# EAGLE design pre_amp (EAGLE 7.2.0)
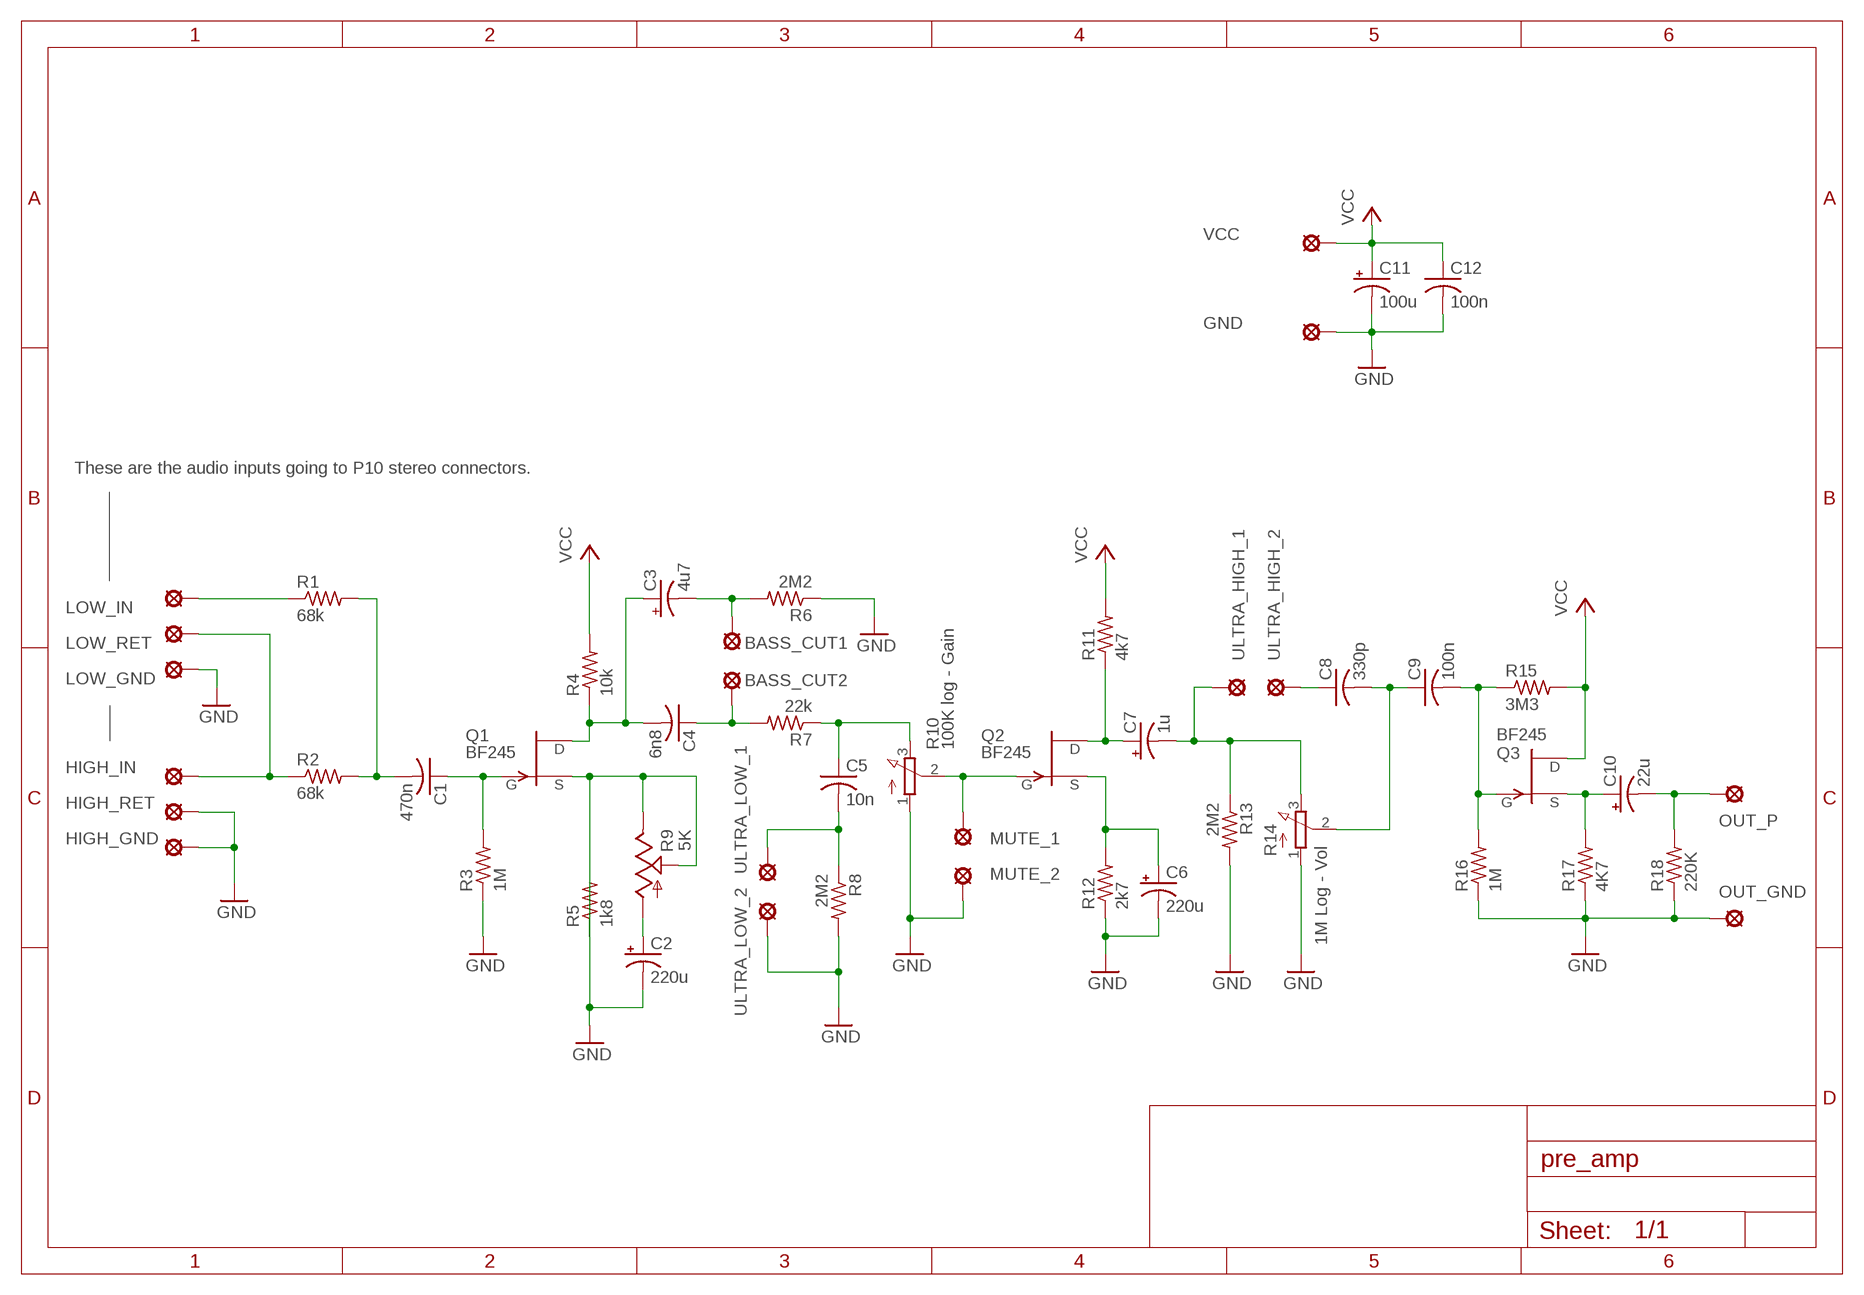
[diagram p0: schematic, sheet 1]

## Parts
BASS_CUT1  MCS08  [MCS08]
BASS_CUT2  MCS08  [MCS08]
C1  470n  C-US050-035X075  [C050-035X075]
C2  220u  CPOL-USE5-8.5  [E5-8,5]
C3  4u7  CPOL-USE2.5-6  [E2,5-6]
C4  6n8  C-US050-030X075  [C050-030X075]
C5  10n  C-US050-030X075  [C050-030X075]
C6  220u  CPOL-USE3.5-8  [E3,5-8]
C7  1u  CPOL-USE2.5-6  [E2,5-6]
C8  330p  C-US050-025X075  [C050-025X075]
C9  100n  C-US075-042X103  [C075-042X103]
C10  22u  CPOL-USE2-5  [E2-5]
C11  100u  CPOL-USE3.5-10  [E3,5-10]
C12  100n  C-US075-042X103  [C075-042X103]
GND  MCS08  [MCS08]
HIGH_GND  MCS08  [MCS08]
HIGH_IN  MCS08  [MCS08]
HIGH_RET  MCS08  [MCS08]
LOW_GND  MCS08  [MCS08]
LOW_IN  MCS08  [MCS08]
LOW_RET  MCS08  [MCS08]
MUTE_1  MCS08  [MCS08]
MUTE_2  MCS08  [MCS08]
OUT_GND  MCS08  [MCS08]
OUT_P  MCS08  [MCS08]
Q1  BF245  [TO92]
Q2  BF245  [TO92]
Q3  BF245  [TO92]
R1  68k  R-US_0204/7  [0204/7]
R2  68k  R-US_0204/7  [0204/7]
R3  1M  R-US_0204/7  [0204/7]
R4  10k  R-US_0204/7  [0204/7]
R5  1k8  R-US_0207/10  [0207/10]
R6  2M2  R-US_0204/7  [0204/7]
R7  22k  R-US_0204/7  [0204/7]
R8  2M2  R-US_0204/7  [0204/7]
R9  5K  TRIM_US-CA6V  [CA6V]
R10  100K log - Gain  3RP/1610N  [3RP/1610N]
R11  4k7  R-US_0204/7  [0204/7]
R12  2k7  R-US_0204/7  [0204/7]
R13  2M2  R-US_0204/7  [0204/7]
R14  1M Log - Vol  3RP/1610N  [3RP/1610N]
R15  3M3  R-US_0204/7  [0204/7]
R16  1M  R-US_0204/7  [0204/7]
R17  4K7  R-US_0204/7  [0204/7]
R18  220K  R-US_0204/7  [0204/7]
ULTRA_HIGH_1  MCS08  [MCS08]
ULTRA_HIGH_2  MCS08  [MCS08]
ULTRA_LOW_1  MCS08  [MCS08]
ULTRA_LOW_2  MCS08  [MCS08]
VCC  MCS08  [MCS08]

## Nets
GND [Power]: C2.- C6.- C11.- C12.2 GND.MP HIGH_GND.MP HIGH_RET.MP LOW_GND.MP MUTE_2.MP OUT_GND.MP R3.1 R5.2 R6.1 R8.2 R10.1(A) R12.1 R13.2 R14.1(A) R16.1 R17.1 R18.1 ULTRA_LOW_2.MP
N$1: C1.2 R1.2 R2.2
N$2: C1.1 Q1.3(G) R3.2
N$3: C3.+ C4.2 Q1.1(D) R4.1
N$4: Q1.2(S) R5.1 R9.E R9.S
N$5: C2.+ R9.A
N$6: LOW_IN.MP R1.1
N$7: HIGH_IN.MP LOW_RET.MP R2.1
N$8: BASS_CUT1.MP C3.- R6.2
N$9: BASS_CUT2.MP C4.1 R7.2
N$10: C5.1 R7.1 R10.3(E)
N$11: C5.2 R8.1 ULTRA_LOW_1.MP
N$12: C7.+ Q2.1(D) R11.1
N$13: C6.+ Q2.2(S) R12.2
N$14: C7.- R13.1 R14.3(E) ULTRA_HIGH_1.MP
N$15: MUTE_1.MP Q2.3(G) R10.2(S)
N$16: C8.2 C9.1 R14.2(S)
N$17: C8.1 ULTRA_HIGH_2.MP
N$18: C9.2 Q3.3(G) R15.1 R16.2
N$19: C10.+ Q3.2(S) R17.2
N$20: C10.- OUT_P.MP R18.2
VCC [Power]: C11.+ C12.1 Q3.1(D) R4.2 R11.2 R15.2 VCC.MP

## Notes on the sheet
- These are the audio inputs going to P10 stereo connectors.

## Library data of the parts
BASS_CUT1 BASS_CUT2 GND HIGH_GND HIGH_IN HIGH_RET LOW_GND LOW_IN LOW_RET MUTE_1 MUTE_2 OUT_GND OUT_P ULTRA_HIGH_1 ULTRA_HIGH_2 ULTRA_LOW_1 ULTRA_LOW_2 VCC = solpad:MCS08: SOLDER PAD MC S0,8, drill 1.2 mm, distributor Buerklin, 08F130
C1 = resistor:C-US: CAPACITOR, American symbol
C2 C3 C6 = resistor:CPOL-US: POLARIZED CAPACITOR, American symbol
C4 C5 C8 C9 C12 = rcl:C-US: CAPACITOR, American symbol
C7 C10 C11 = rcl:CPOL-US: POLARIZED CAPACITOR, American symbol
Q1-Q3 = transistor-fet:BF245: N-Channel Junction FET http://www.onsemi.com/pub/Collateral/BF245A-D.PDF
R1-R8 R11-R13 R15-R18 = resistor:R-US_: RESISTOR, American symbol
R9 = pot:TRIM_US-: POTENTIOMETER
R10 R14 = pot:3RP/1610N: 16mm Potentiometer one level Source: http://www.alphapotentiometers.net/html/16mm_pot_2.html

## Net classes
0 default: width 1.016 mm, clearance 0.813 mm
1 Power: width 1.219 mm, clearance 1.016 mm

## Board
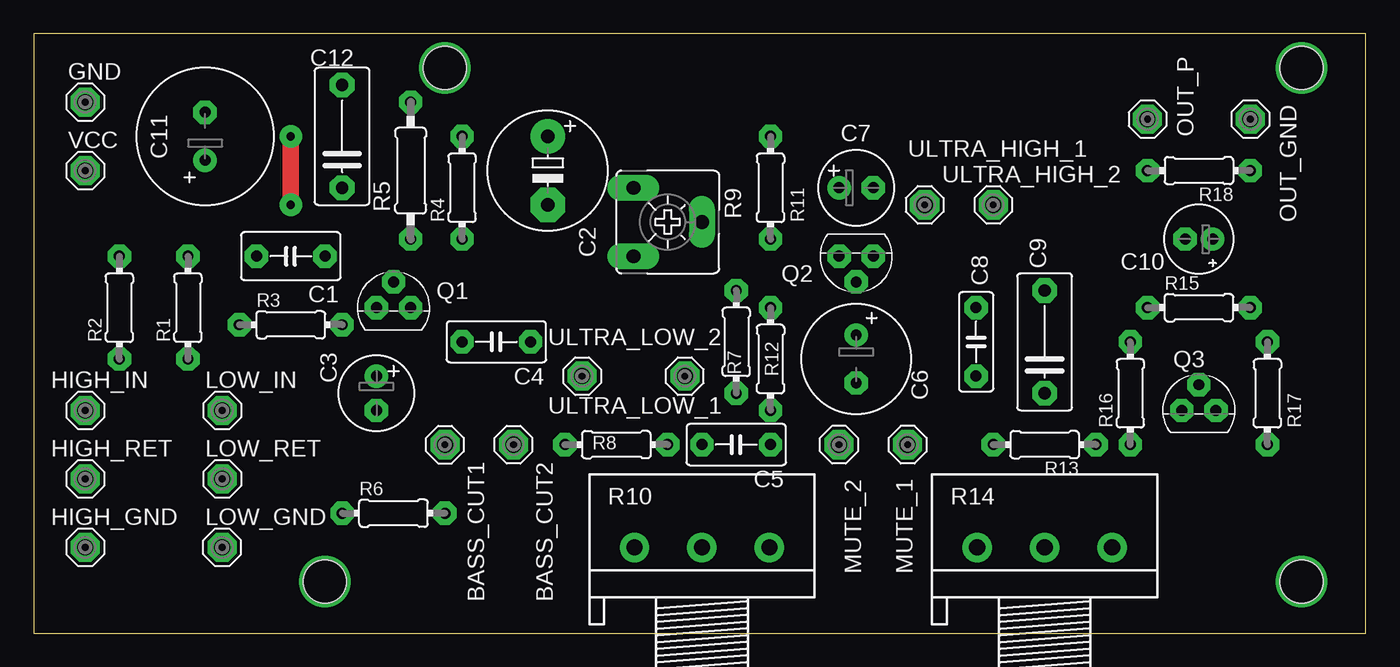
[diagram p1: board, top side]
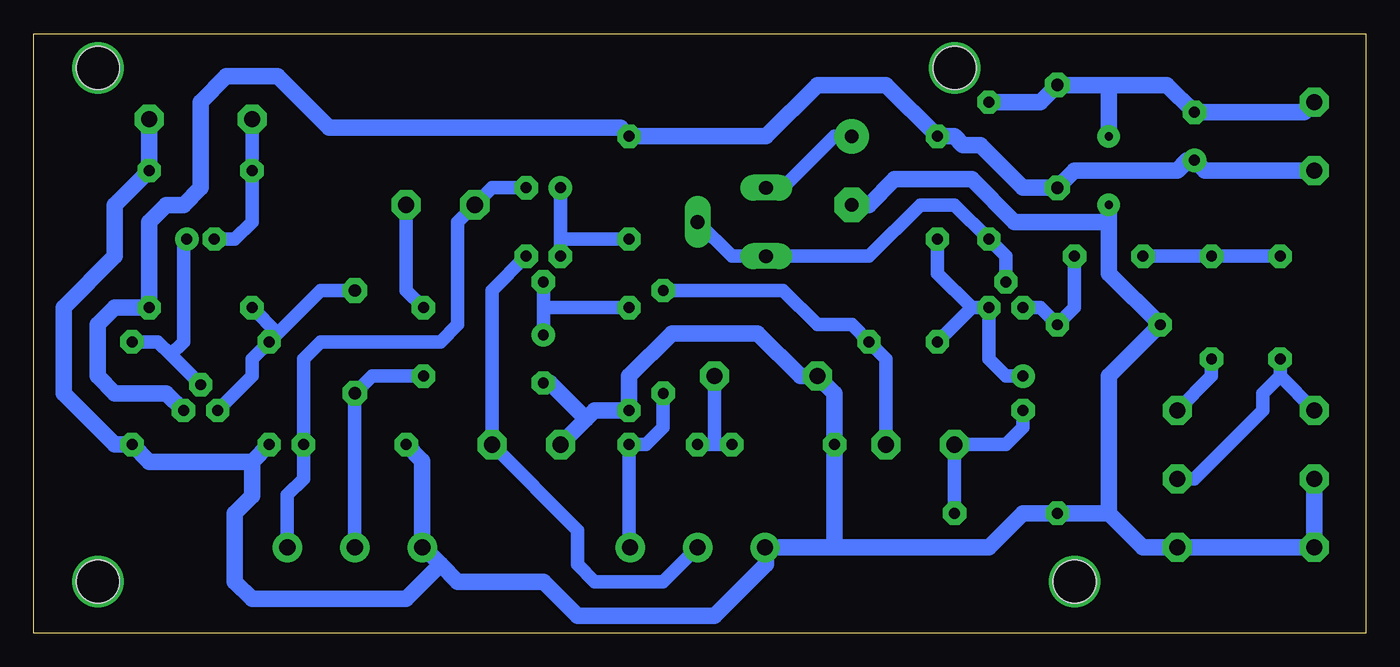
[diagram p2: board, bottom side, seen from below]

Size 98.73 x 44.44 mm. Coordinates in mm from the lower left corner, seen from the top.
Outline: 0,0 98.73,0 98.73,44.44 0,44.44 0,0
Copper layers (1*16): Top 0.035mm / dielectric 1.5mm / Bottom 0.035mm
Design rules "default *": minimum track width 10mil, minimum drill 24mil, track to track 8mil, track to pad 8mil, pad to pad 8mil, via to via 8mil, smd to smd 8mil, copper to edge 40mil, drill to drill 8mil, minimum pad ring 18mil, minimum via ring 8mil, stop-mask expansion 4mil, vias tented up to drill 0mil, thermal gap 10mil
Holes 3.2 mm at 21.59,3.81 30.48,41.91 93.98,3.81 93.98,41.91

### Footprints (pad centres in the part's own frame; a part is rotated, then mirrored left to right if it is on the bottom)
MCS08 = drill 1.194 pad 2.159 octagon: MP 0,0
C050-035X075 = drill 0.813 octagon: 1 -2.54,0; 2 2.54,0
E5-8,5 = drill 1.016 pad 2.54: + -2.54,0 | drill 1.016 pad 2.54 octagon: - 2.54,0
E2,5-6 = drill 0.813 pad 1.6: + -1.27,0 | drill 0.813 pad 1.6 octagon: - 1.27,0
C050-030X075 = drill 0.813 octagon: 1 -2.54,0; 2 2.54,0
E3,5-8 = drill 0.813 pad 1.6: + -1.778,0 | drill 0.813 pad 1.6 octagon: - 1.778,0
C050-025X075 = drill 0.813 octagon: 1 -2.54,0; 2 2.54,0
C075-042X103 = drill 0.914 octagon: 1 -3.81,0; 2 3.81,0
E2-5 = drill 0.813 pad 1.27: + -1.016,0 | drill 0.813 pad 1.27 octagon: - 1.016,0
E3,5-10 = drill 0.813 pad 1.6: + -1.778,0 | drill 0.813 pad 1.6 octagon: - 1.778,0
TO92 = drill 0.813 octagon: 1 1.27,0; 2 0,1.905; 3 -1.27,0
0204/7 = drill 0.813 octagon: 1 -3.81,0; 2 3.81,0
0207/10 = drill 0.813 octagon: 1 -5.08,0; 2 5.08,0
CA6V = drill 1.016 long: A -2.54,-2.54; E 2.54,-2.54; S 0,2.54
3RP/1610N = drill 1.2 pad 2.184: 1 -5,0; 2 0,0; 3 5,0

### Placement (x,y rotation side)
BASS_CUT1  30.48,13.97 90 top
BASS_CUT2  35.56,13.97 180 top
C1  19.05,27.94 180 top
C2  38.1,34.29 270 top
C3  25.4,17.78 270 top
C4  34.29,21.59 180 top
C5  52.07,13.97 180 top
C6  60.96,20.32 270 top
C7  60.96,33.02 0 top
C8  69.85,21.59 270 top
C9  74.93,21.59 90 top
C10  86.36,29.21 180 top
C11  12.7,36.83 90 top
C12  22.86,36.83 90 top
GND  3.81,39.37 0 top
HIGH_GND  3.81,6.35 0 top
HIGH_IN  3.81,16.51 0 top
HIGH_RET  3.81,11.43 0 top
LOW_GND  13.97,6.35 180 top
LOW_IN  13.97,16.51 0 top
LOW_RET  13.97,11.43 0 top
MUTE_1  64.77,13.97 270 top
MUTE_2  59.69,13.97 270 top
OUT_GND  90.17,38.1 0 top
OUT_P  82.55,38.1 0 top
Q1  26.67,24.13 0 top
Q2  60.96,27.94 180 top
Q3  86.36,16.51 0 top
R1  11.43,24.13 90 top
R2  6.35,24.13 90 top
R3  19.05,22.86 0 top
R4  31.75,33.02 90 top
R5  27.94,34.29 90 top
R6  26.67,8.89 0 top
R7  52.07,21.59 90 top
R8  43.18,13.97 180 top
R9  46.99,30.48 270 top
R10  49.53,6.35 0 top
R11  54.61,33.02 90 top
R12  54.61,20.32 90 top
R13  74.93,13.97 180 top
R14  74.93,6.35 0 top
R15  86.36,24.13 0 top
R16  81.28,17.78 90 top
R17  91.44,17.78 90 top
R18  86.36,34.29 180 top
ULTRA_HIGH_1  66.04,31.75 0 top
ULTRA_HIGH_2  71.12,31.75 0 top
ULTRA_LOW_1  48.26,19.05 180 top
ULTRA_LOW_2  40.64,19.05 0 top
VCC  3.81,34.29 0 top

### Tracks (layer width: path | path; a pad name or v marks a point on that pad's centre or on a via)
GND  (via drill 0.61 pad 1.68)
  Top 1.219: v19.05,31.75 v19.05,36.83
  Bottom 1.219: HIGH_RET.MP HIGH_GND.MP LOW_GND.MP 16.51,6.35 19.05,8.89 | 19.05,8.89 R6.1 25.4,8.89 27.94,6.35 39.37,6.35 | 19.05,8.89 19.05,19.05 R3.1 19.05,26.67 19.05,30.48 | GND.MP 4.57,38.61 C11.- 14.73,40.64 19.05,40.64 | 19.05,40.64 C12.2 24.13,39.37 R5.2 | 39.37,6.35 R10.1 44.45,6.27 44.45,5.08 48.26,1.27 58.42,1.27 60.96,3.81 67.31,3.81 68.58,5.08 | 39.37,6.35 R8.2 39.37,17.78 ULTRA_LOW_2.MP 41.91,19.05 45.09,22.23 51.44,22.23 54.61,19.05 R12.1 57.15,16.51 57.78,15.88 | MUTE_2.MP 57.78,15.88 | C6.- 60.45,18.54 57.78,15.88 | R13.2 69.93,12.78 R14.1 69.85,6.35 68.58,5.08 | 82.55,12.7 90.17,12.7 R17.1 92.71,13.97 96.52,17.78 96.52,24.13 92.71,27.94 92.71,31.75 R18.1 OUT_GND.MP | 82.55,12.7 R16.1 | 19.05,30.48 v19.05,31.75 | v19.05,36.83 19.05,40.64 | C2.- 36.83,31.75 34.92,33.66 29.21,33.66 26.04,30.48 19.05,30.48 | 82.55,12.7 82.55,10.16 83.82,8.89 83.82,3.81 82.55,2.54 71.12,2.54 68.58,5.08
N$1
  Bottom 1.016: R2.2 R1.2 C1.2
N$2
  Bottom 1.016: C1.1 21.59,24.13 R3.2 24.13,24.13 Q1.3
N$3
  Bottom 1.016: R4.1 31.75,26.67 29.21,24.13 | 29.21,24.13 Q1.1 27.94,20.32 26.67,19.05 C3.+ | C4.2 29.21,24.13
N$4
  Bottom 1.016: Q1.2 26.67,27.94 R5.1 30.48,31.75 33.02,31.75 36.83,27.94 R9.E 46.99,27.94 R9.S
N$5
  Bottom 1.016: C2.+ 39.37,36.83 43.18,33.02 R9.A
N$6
  Bottom 1.016: LOW_IN.MP 11.43,19.05 R1.1
N$7
  Bottom 1.016: R2.1 6.35,19.05 | 6.35,19.05 HIGH_IN.MP | LOW_RET.MP 12.7,11.43 7.62,16.51 7.62,17.78 6.35,19.05
N$8
  Bottom 1.016: C3.- 25.4,15.24 26.67,13.97 BASS_CUT1.MP R6.2
N$9
  Bottom 1.016: BASS_CUT2.MP 35.56,20.32 C4.1 38.1,22.86 40.64,22.86 43.18,25.4 R7.2
N$10
  Bottom 1.016: R7.1 52.07,15.24 53.34,13.97 C5.1 54.61,6.35 R10.3
N$11
  Bottom 1.016: R8.1 48.26,13.97 | 48.26,13.97 C5.2 | ULTRA_LOW_1.MP 48.26,13.97
N$12
  Bottom 1.016: Q2.1 59.69,29.21 | 59.69,29.21 C7.+ | R11.1 59.69,29.21
N$13
  Bottom 1.016: C6.+ 60.96,24.13 | 60.96,24.13 Q2.2 | R12.2 60.96,24.13
N$14
  Bottom 1.016: C7.- 64.77,33.02 ULTRA_HIGH_1.MP 67.31,30.48 67.31,22.86 68.58,21.59 77.47,21.59 78.74,20.32 R13.1 78.74,11.43 79.93,10.24 R14.3
N$15
  Bottom 1.016: R10.2 52.07,3.81 57.15,3.81 58.42,5.08 58.42,7.62 MUTE_1.MP 64.77,25.4 Q2.3
N$16
  Bottom 1.016: R14.2 C9.1 73.66,19.05 C8.2
N$17
  Bottom 1.016: ULTRA_HIGH_2.MP 71.12,25.4 C8.1
N$18
  Bottom 1.016: C9.2 77.47,25.4 80.64,22.23 | 80.64,22.23 R16.2 82.55,20.32 82.55,19.05 Q3.3 | R15.1 80.64,22.23
N$19
  Bottom 1.016: R17.2 89.53,21.59 88.58,20.64 | 88.58,20.64 Q3.2 | C10.+ 87.63,28.96 87.63,21.59 88.58,20.64
N$20
  Bottom 1.016: C10.- 83.82,29.21 82.55,30.48 R18.2 OUT_P.MP
N$21  (via drill 2.8 pad 3.81)
  other vias: 30.48,41.91
N$22  (via drill 2.8 pad 3.81)
  other vias: 93.98,41.91
N$23  (via drill 2.8 pad 3.81)
  other vias: 93.98,3.81
N$24  (via drill 2.8 pad 3.81)
  other vias: 21.59,3.81
VCC
  Bottom 1.219: Q3.1 88.9,17.78 92.71,17.78 93.98,19.05 93.98,22.86 92.71,24.13 R15.2 90.17,30.48 88.9,31.75 87.63,31.75 86.36,33.02 86.36,39.37 84.45,41.27 80.64,41.27 76.83,37.47 55.24,37.47 R11.2 44.45,36.83 40.64,40.64 35.56,40.64 R4.2 30.48,36.83 29.84,36.2 28.57,36.2 25.4,33.02 C12.1 21.59,34.29 13.97,34.29 13.21,35.05 C11.+ 11.94,34.29 VCC.MP